# EAGLE schematic montaj_nrf24l01 (EAGLE 9.6.2)
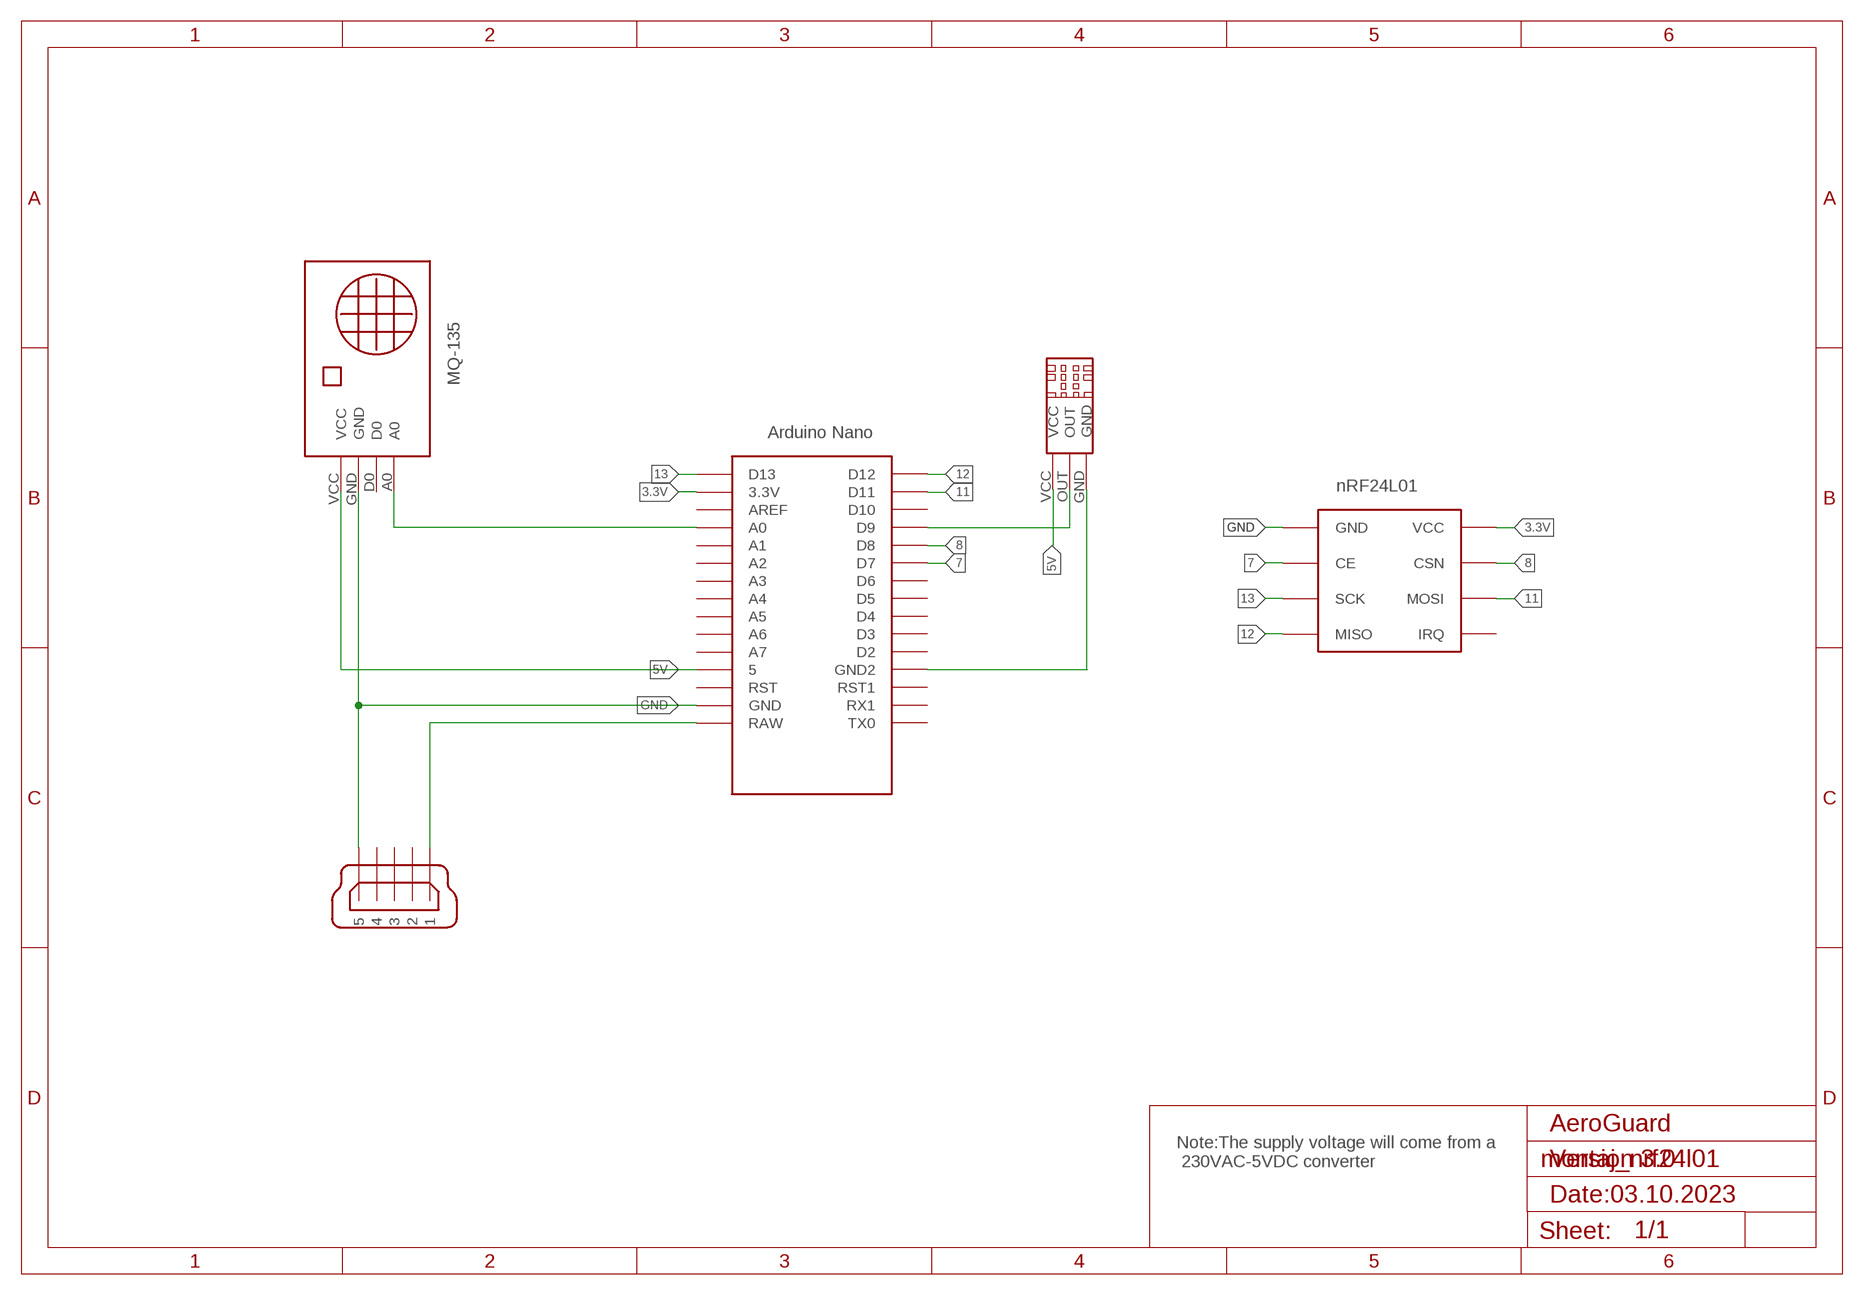
[diagram p0: schematic, sheet 1]

## Parts
GND  NANO  [NANO]
U$1  DHT11  [DHT11]
U$2  DEV  [FOOT]
U$3  NRF24L01  [NRF24L01]
X1  MINI-USB-SHIELD-UX60-MB-5S8  [UX60-MB-5S8]

## Nets
3.3V: U$3.VCC
5V: GND.5V U$2.VCC
7: U$3.CE
8: U$3.CSN
11: U$3.MOSI
12: U$3.MISO
13: U$3.SCK
GND: U$3.GND
N$1: GND.A0 U$2.A0
N$2: GND.D11
N$3: GND.D9 U$1.OUT
N$4: GND.D13
N$5: GND.D8
N$6: U$1.VCC
N$7: GND.3.3V
N$8: GND.RAW X1.1
N$9: GND.D7
N$10: GND.GND U$2.GND X1.5
N$11: GND.GND1(GND2) U$1.GND
N$14: GND.D12
Unconnected: GND.A1 GND.A2 GND.A3 GND.A4 GND.A5 GND.A6 GND.A7 GND.AREF GND.D2 GND.D3 GND.D4 GND.D5 GND.D6 GND.D10 GND.ICSP1 GND.ICSP2 GND.ICSP3 GND.ICSP4 GND.ICSP5 GND.ICSP6 GND.RST GND.RST1 GND.RX1 GND.TX0 U$2.D0 U$3.IRQ X1.2 X1.3 X1.4 X1.M1(S1) X1.M2(S2) X1.M3(S3) X1.M4(S4)

## Notes on the sheet
- AeroGuard
- Note:The supply voltage will come from a
   230VAC-5VDC converter
- Version 3.0
- Date:03.10.2023

## Library data of the parts
GND = Arduino-clone:NANO: Arduino Nano
U$1 = componente:DHT11: Senzor de temperatură și umiditate DHT11
U$2 = MQ-135(test):DEV
U$3 = nrf24l01:NRF24L01: Modul radio nRF24L01
X1 = con-hirose:MINI-USB-SHIELD-: MINI USB Connector Source: http://www.hirose.co.jp/cataloge_hp/e24000019.pdf; OC_FARNELL: unknown; OC_NEWARK: unknown